# EAGLE design ROMSIMMProgrammer (EAGLE 6.1)
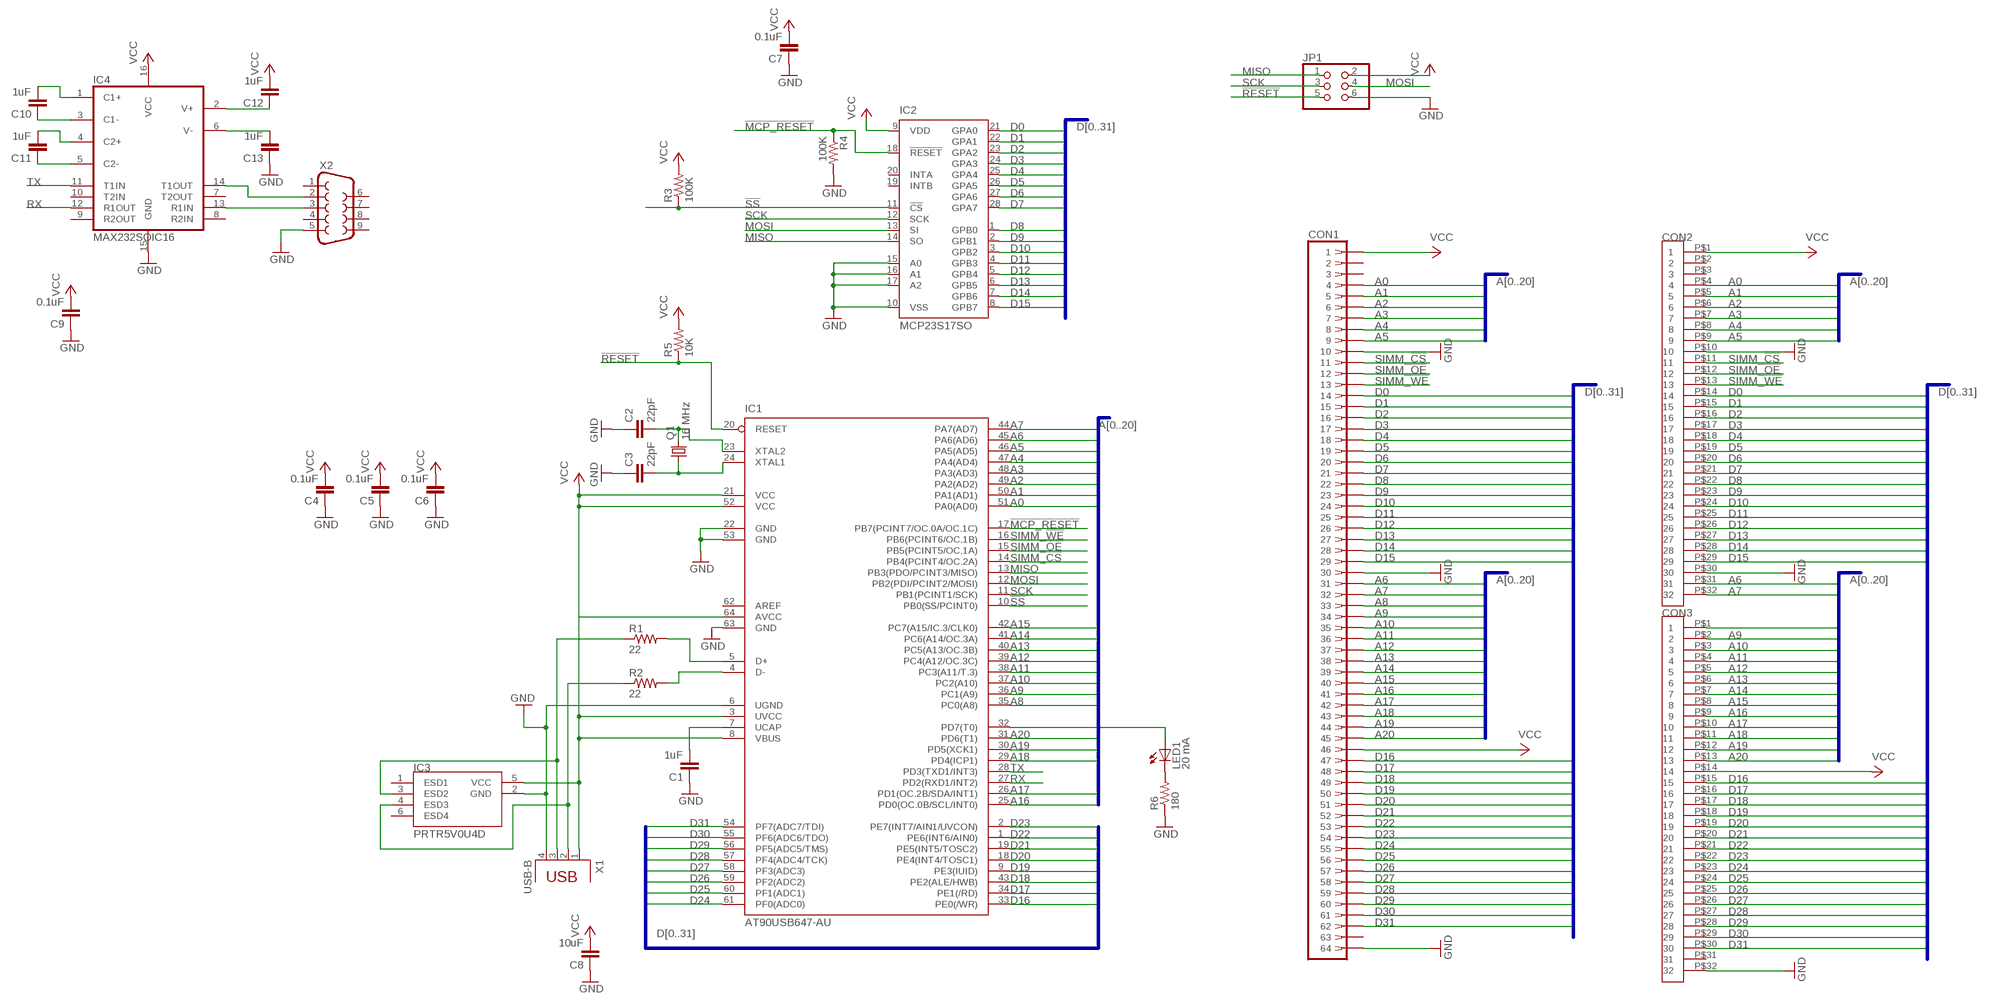
[diagram p0: schematic, sheet 1]

## Parts
C1  1uF  C-EUC0805  [C0805]
C2  22pF  C-EUC0805  [C0805]
C3  22pF  C-EUC0805  [C0805]
C4  0.1uF  C-EUC0805  [C0805]
C5  0.1uF  C-EUC0805  [C0805]
C6  0.1uF  C-EUC0805  [C0805]
C7  0.1uF  C-EUC0805  [C0805]
C8  10uF  C-EUC0805  [C0805]
C9  0.1uF  C-EUC0805  [C0805]
C10  1uF  C-EUC0805  [C0805]
C11  1uF  C-EUC0805  [C0805]
C12  1uF  C-EUC0805  [C0805]
C13  1uF  C-EUC0805  [C0805]
CON1  SIMM64  [822032-2]
CON2  SMS-132-01-G-S  [SMS-132-01-G-S]
CON3  SMS-132-01-G-S  [SMS-132-01-G-S]
IC1  AT90USB647-AU  [TQFP64]
IC2  MCP23S17SO  [SO28W]
IC3  PRTR5V0U4D  [SOT457R_PHILIPS]
IC4  MAX232SOIC16  [SO016]
JP1  PINHD-2X3  [2X03]
LED1  20 mA  LEDCHIP-LED0805  [CHIP-LED0805]
Q1  16 MHz  CRYSTALHC49UP  [HC49UP]
R1  22  R-US_R0805  [R0805]
R2  22  R-US_R0805  [R0805]
R3  100K  R-US_R0805  [R0805]
R4  100K  R-US_R0805  [R0805]
R5  10K  R-US_R0805  [R0805]
R6  180  R-US_R0805  [R0805]
X1  USB-B  PN61729  [PN61729]
X2  DB9FEMALE  [DB9]

## Nets
!MCP_RESET: IC1.17(PB7(PCINT7/OC.0A/OC.1C)) IC2.18(!RESET) R4.1
!RESET: IC1.20(RESET) JP1.5 R5.1
!SS: IC1.10(PB0(SS/PCINT0)) IC2.11(!CS) R3.1
A0: CON1.4 CON2.P$4 IC1.51(PA0(AD0))
A1: CON1.5 CON2.P$5 IC1.50(PA1(AD1))
A2: CON1.6 CON2.P$6 IC1.49(PA2(AD2))
A3: CON1.7 CON2.P$7 IC1.48(PA3(AD3))
A4: CON1.8 CON2.P$8 IC1.47(PA4(AD4))
A5: CON1.9 CON2.P$9 IC1.46(PA5(AD5))
A6: CON1.31 CON2.P$31 IC1.45(PA6(AD6))
A7: CON1.32 CON2.P$32 IC1.44(PA7(AD7))
A8: CON1.33 CON3.P$1 IC1.35(PC0(A8))
A9: CON1.34 CON3.P$2 IC1.36(PC1(A9))
A10: CON1.35 CON3.P$3 IC1.37(PC2(A10))
A11: CON1.36 CON3.P$4 IC1.38(PC3(A11/T.3))
A12: CON1.37 CON3.P$5 IC1.39(PC4(A12/OC.3C))
A13: CON1.38 CON3.P$6 IC1.40(PC5(A13/OC.3B))
A14: CON1.39 CON3.P$7 IC1.41(PC6(A14/OC.3A))
A15: CON1.40 CON3.P$8 IC1.42(PC7(A15/IC.3/CLK0))
A16: CON1.41 CON3.P$9 IC1.25(PD0(OC.0B/SCL/INT0))
A17: CON1.42 CON3.P$10 IC1.26(PD1(OC.2B/SDA/INT1))
A18: CON1.43 CON3.P$11 IC1.29(PD4(ICP1))
A19: CON1.44 CON3.P$12 IC1.30(PD5(XCK1))
A20: CON1.45 CON3.P$13 IC1.31(PD6(T1))
D0: CON1.14 CON2.P$14 IC2.21(GPA0)
D1: CON1.15 CON2.P$15 IC2.22(GPA1)
D2: CON1.16 CON2.P$16 IC2.23(GPA2)
D3: CON1.17 CON2.P$17 IC2.24(GPA3)
D4: CON1.18 CON2.P$18 IC2.25(GPA4)
D5: CON1.19 CON2.P$19 IC2.26(GPA5)
D6: CON1.20 CON2.P$20 IC2.27(GPA6)
D7: CON1.21 CON2.P$21 IC2.28(GPA7)
D8: CON1.22 CON2.P$22 IC2.1(GPB0)
D9: CON1.23 CON2.P$23 IC2.2(GPB1)
D10: CON1.24 CON2.P$24 IC2.3(GPB2)
D11: CON1.25 CON2.P$25 IC2.4(GPB3)
D12: CON1.26 CON2.P$26 IC2.5(GPB4)
D13: CON1.27 CON2.P$27 IC2.6(GPB5)
D14: CON1.28 CON2.P$28 IC2.7(GPB6)
D15: CON1.29 CON2.P$29 IC2.8(GPB7)
D16: CON1.47 CON3.P$15 IC1.33(PE0(/WR))
D17: CON1.48 CON3.P$16 IC1.34(PE1(/RD))
D18: CON1.49 CON3.P$17 IC1.43(PE2(ALE/HWB))
D19: CON1.50 CON3.P$18 IC1.9(PE3(IUID))
D20: CON1.51 CON3.P$19 IC1.18(PE4(INT4/TOSC1))
D21: CON1.52 CON3.P$20 IC1.19(PE5(INT5/TOSC2))
D22: CON1.53 CON3.P$21 IC1.1(PE6(INT6/AIN0))
D23: CON1.54 CON3.P$22 IC1.2(PE7(INT7/AIN1/UVCON))
D24: CON1.55 CON3.P$23 IC1.61(PF0(ADC0))
D25: CON1.56 CON3.P$24 IC1.60(PF1(ADC1))
D26: CON1.57 CON3.P$25 IC1.59(PF2(ADC2))
D27: CON1.58 CON3.P$26 IC1.58(PF3(ADC3))
D28: CON1.59 CON3.P$27 IC1.57(PF4(ADC4/TCK))
D29: CON1.60 CON3.P$28 IC1.56(PF5(ADC5/TMS))
D30: CON1.61 CON3.P$29 IC1.55(PF6(ADC6/TDO))
D31: CON1.62 CON3.P$30 IC1.54(PF7(ADC7/TDI))
D+: IC3.3(ESD2) R1.1 X1.3
D-: IC3.4(ESD3) R2.1 X1.2
GND [thick]: C1.1 C2.1 C3.1 C4.1 C5.1 C6.1 C7.1 C8.1 C9.1 C13.1 CON1.10 CON1.30 CON1.64 CON2.P$10 CON2.P$30 CON3.P$32 IC1.6(UGND) IC1.22(GND) IC1.53(GND) IC1.63(GND) IC2.10(VSS) IC2.15(A0) IC2.16(A1) IC2.17(A2) IC3.2(GND) IC4.15(GND) JP1.6 R4.2 R6.1 X1.4 X2.5
MISO: IC1.13(PB3(PDO/PCINT3/MISO)) IC2.14(SO) JP1.1
MOSI: IC1.12(PB2(PDI/PCINT2/MOSI)) IC2.13(SI) JP1.4
N$1: IC1.5(D+) R1.2
N$2: IC1.4(D-) R2.2
N$3: C2.2 IC1.23(XTAL2) Q1.2
N$4: C3.2 IC1.24(XTAL1) Q1.1
N$5: C10.2 IC4.1(C1+)
N$6: C1.2 IC1.7(UCAP)
N$7: C10.1 IC4.3(C1-)
N$8: C11.1 IC4.5(C2-)
N$9: C11.2 IC4.4(C2+)
N$10: C12.1 IC4.2(V+)
N$11: C13.2 IC4.6(V-)
N$12: IC4.14(T1OUT) X2.2
N$13: IC4.13(R1IN) X2.3
N$14: IC1.32(PD7(T0)) LED1.A
N$15: LED1.C R6.2
RX: IC1.27(PD2(RXD1/INT2)) IC4.12(R1OUT)
SCK: IC1.11(PB1(PCINT1/SCK)) IC2.12(SCK) JP1.3
SIMM_!CS: CON1.11 CON2.P$11 IC1.14(PB4(PCINT4/OC.2A))
SIMM_!OE: CON1.12 CON2.P$12 IC1.15(PB5(PCINT5/OC.1A))
SIMM_!WE: CON1.13 CON2.P$13 IC1.16(PB6(PCINT6/OC.1B))
TX: IC1.28(PD3(TXD1/INT3)) IC4.11(T1IN)
VCC [thick]: C4.2 C5.2 C6.2 C7.2 C8.2 C9.2 C12.2 CON1.1 CON1.46 CON2.P$1 CON3.P$14 IC1.3(UVCC) IC1.8(VBUS) IC1.21(VCC) IC1.52(VCC) IC1.64(AVCC) IC2.9(VDD) IC3.5(VCC) IC4.16(VCC) JP1.2 R3.2 R5.2 X1.1
Unconnected: CON1.2 CON1.3 CON1.63 CON2.P$2 CON2.P$3 CON3.P$31 IC1.62(AREF) IC2.19(INTB) IC2.20(INTA) IC3.1(ESD1) IC3.6(ESD4) IC4.7(T2OUT) IC4.8(R2IN) IC4.9(R2OUT) IC4.10(T2IN) X2.1 X2.4 X2.6 X2.7 X2.8 X2.9

## Buses
D[0..31]
A[0..20]

## Library data of the parts
C1-C13 = rcl:C-EU: CAPACITOR, European symbol
CON1 = Doug:SIMM64: AMP connector; OC_FARNELL: unknown; OC_NEWARK: unknown
CON2 CON3 = Doug:SMS-132-01-G-S
IC1 = at90usb:AT90USB647-*: Atmel AT90USB647 AVR Microcontroller with USB Interface and 64kB Flash Memory
IC2 = microchip:MCP23S17: http://ww1.microchip.com/downloads/en/DeviceDoc/21952a.pdf Source: http://ww1.microchip.com/downloads/en/DeviceDoc/21952a.pdf; MF: MICROCHIP; MPN: MCP23S17-E/SO; OC_FARNELL: unknown; OC_NEWARK: 31K2950
IC3 = Doug:PRTR5V0U4D
IC4 = SparkFun:MAX232: RS232 Transceiver Very common IC. This is generically called 'MAX232', but works with the 3V equivalent MAX3232 generic ICs. Field tested and mother approved. Spark Fun Electronics SKU : COM-00316 (DIP) and COM-00589 (SMD)
JP1 = pinhead:PINHD-2X3: PIN HEADER
LED1 = led:LED: LED OSRAM: - CHIPLED LG R971, LG N971, LY N971, LG Q971, LY Q971, LO R971, LY R971 LH N974, LH R974 LS Q976, LO Q976, LY Q976 LO Q996 - Hyper CHIPLED LW Q18S LB Q993, LB Q99A, LB R99A - SideLED LS A670, LO A670, LY A670, LG A670, LP A670 LB A673, LV A673, LT A673, LW A673 LH A674 LY A675 LS A676, LA A676, LO A676, LY A676, LW A676 LS A679, LY A679, LG A679 - Hyper Micro SIDELED® LS Y876, LA Y876, LO Y876, LY Y876 LT Y87S - SmartLED LW L88C, LW L88S LB L89C, LB L89S, LG L890 LS L89K, LO L89K, LY L89K LS L896, LA L896, LO L896, LY L896 - TOPLED LS T670, LO T670, LY T670, LG T670, LP T670 LSG T670, LSP T670, LSY T670, LOP T670, LYG T670 LG T671, LOG T671, LSG T671 LB T673, LV T673, LT T673, LW T673 LH T674 LS T676, LA T676, LO T676, LY T676, LB T676, LH T676, LSB T676, LW T676 LB T67C, LV T67C, LT T67C, LS T67K, LO T67K, LY T67K, LW E67C LS E67B, LA E67B, LO E67B, LY E67B, LB E67C, LV E67C, LT E67C LW T67C LS T679, LY T679, LG T679 LS T770, LO T770, LY T770, LG T770, LP T770 LB T773, LV T773, LT T773, LW T773 LH T774 LS E675, LA E675, LY E675, LS T675 LS T776, LA T776, LO T776, LY T776, LB T776 LHGB T686 LT T68C, LB T68C - Hyper Mini TOPLED® LB M676 - Mini TOPLED Santana® LG M470 LS M47K, LO M47K, LY M47K Source: http://www.osram.convergy.de LUXEON: - LUMILED® LXK2-PW12-R00, LXK2-PW12-S00, LXK2-PW14-U00, LXK2-PW14-V00 LXK2-PM12-R00, LXK2-PM12-S00, LXK2-PM14-U00 LXK2-PE12-Q00, LXK2-PE12-R00, LXK2-PE12-S00, LXK2-PE14-T00, LXK2-PE14-U00 LXK2-PB12-K00, LXK2-PB12-L00, LXK2-PB12-M00, LXK2-PB14-N00, LXK2-PB14-P00, LXK2-PB14-Q00 LXK2-PR12-L00, LXK2-PR12-M00, LXK2-PR14-Q00, LXK2-PR14-R00 LXK2-PD12-Q00, LXK2-PD12-R00, LXK2-PD12-S00 LXK2-PH12-R00, LXK2-PH12-S00 LXK2-PL12-P00, LXK2-PL12-Q00, LXK2-PL12-R00 Source: www.luxeon.com KINGBRIGHT: KA-3528ASYC Source: www.kingbright.com
Q1 = crystal:CRYSTAL: CRYSTAL; OC_FARNELL: unknown; OC_NEWARK: unknown
R1-R6 = rcl:R-US_: RESISTOR, American symbol
X1 = Doug:PN61729: BERG USB connector; OC_FARNELL: unknown; OC_NEWARK: unknown
X2 = SparkFun:DB9: DB9 Connector Standard DB9 (D-Sub 9) serial connector. Can be used for CAN bus as well as RS485 and RS232. Footprint production proven. Spark Fun Electronics SKU : PRT-00429

## Net classes
0 default: width 0.178 mm
1 thick: width 0.508 mm

## Board
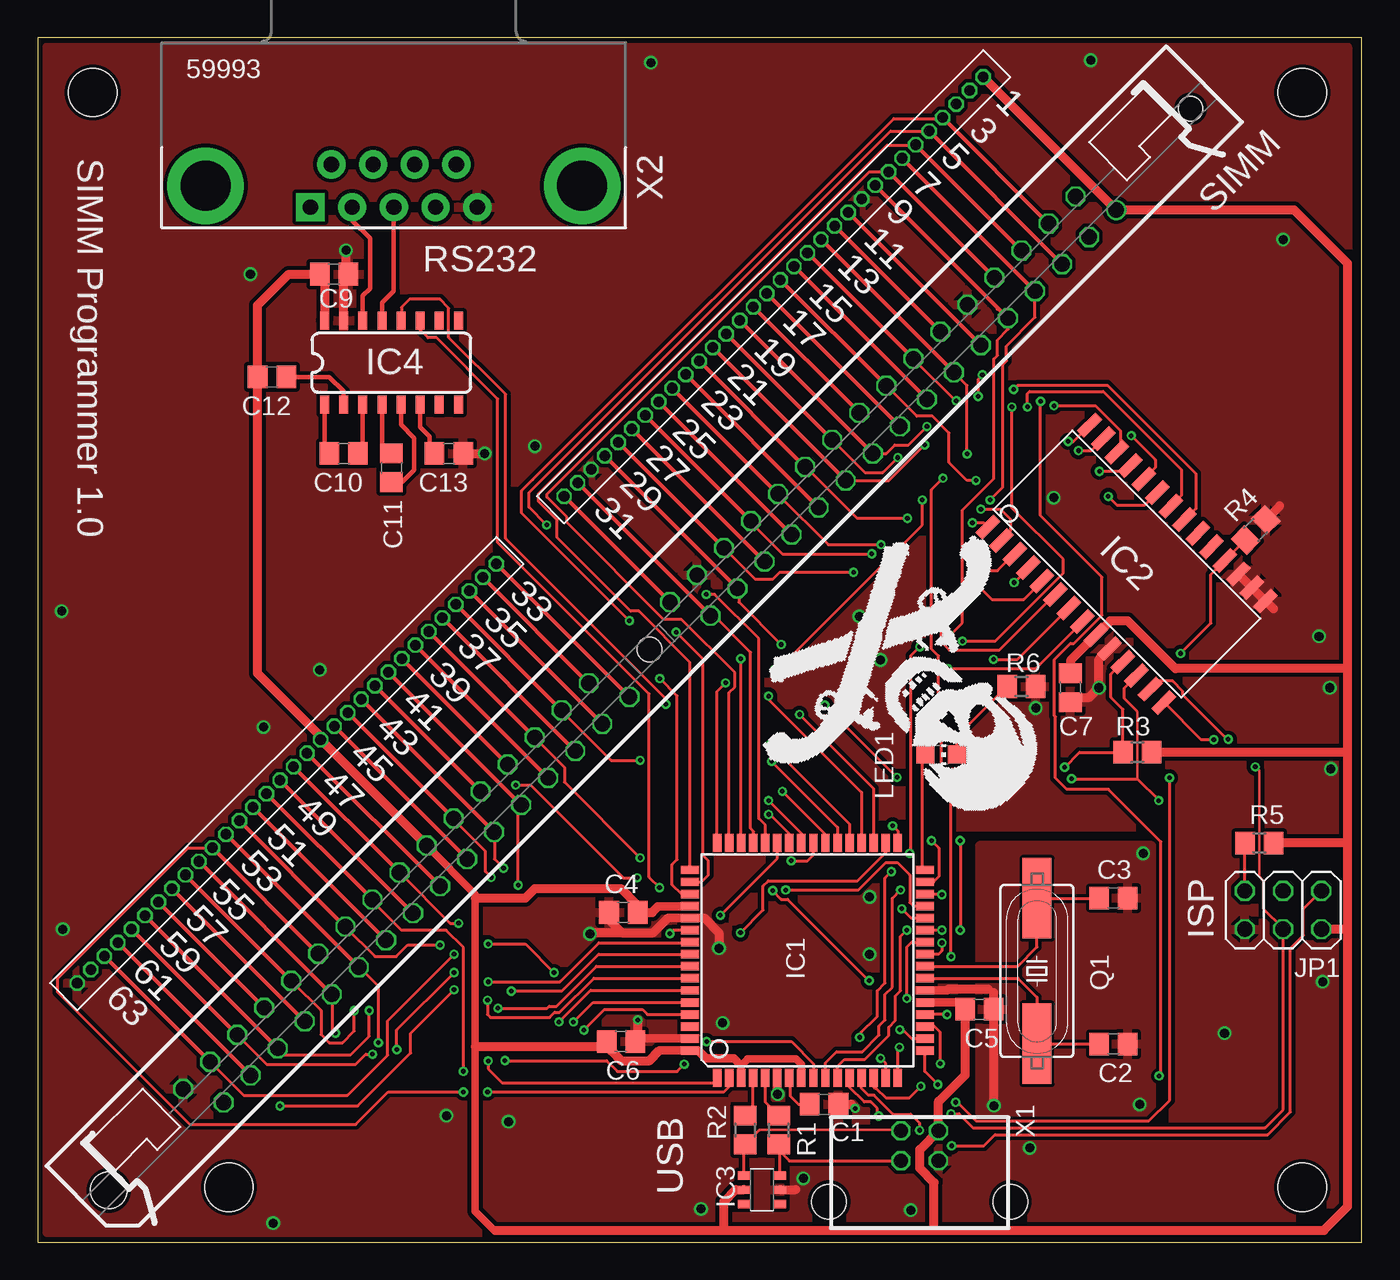
[diagram p1: board, top side]
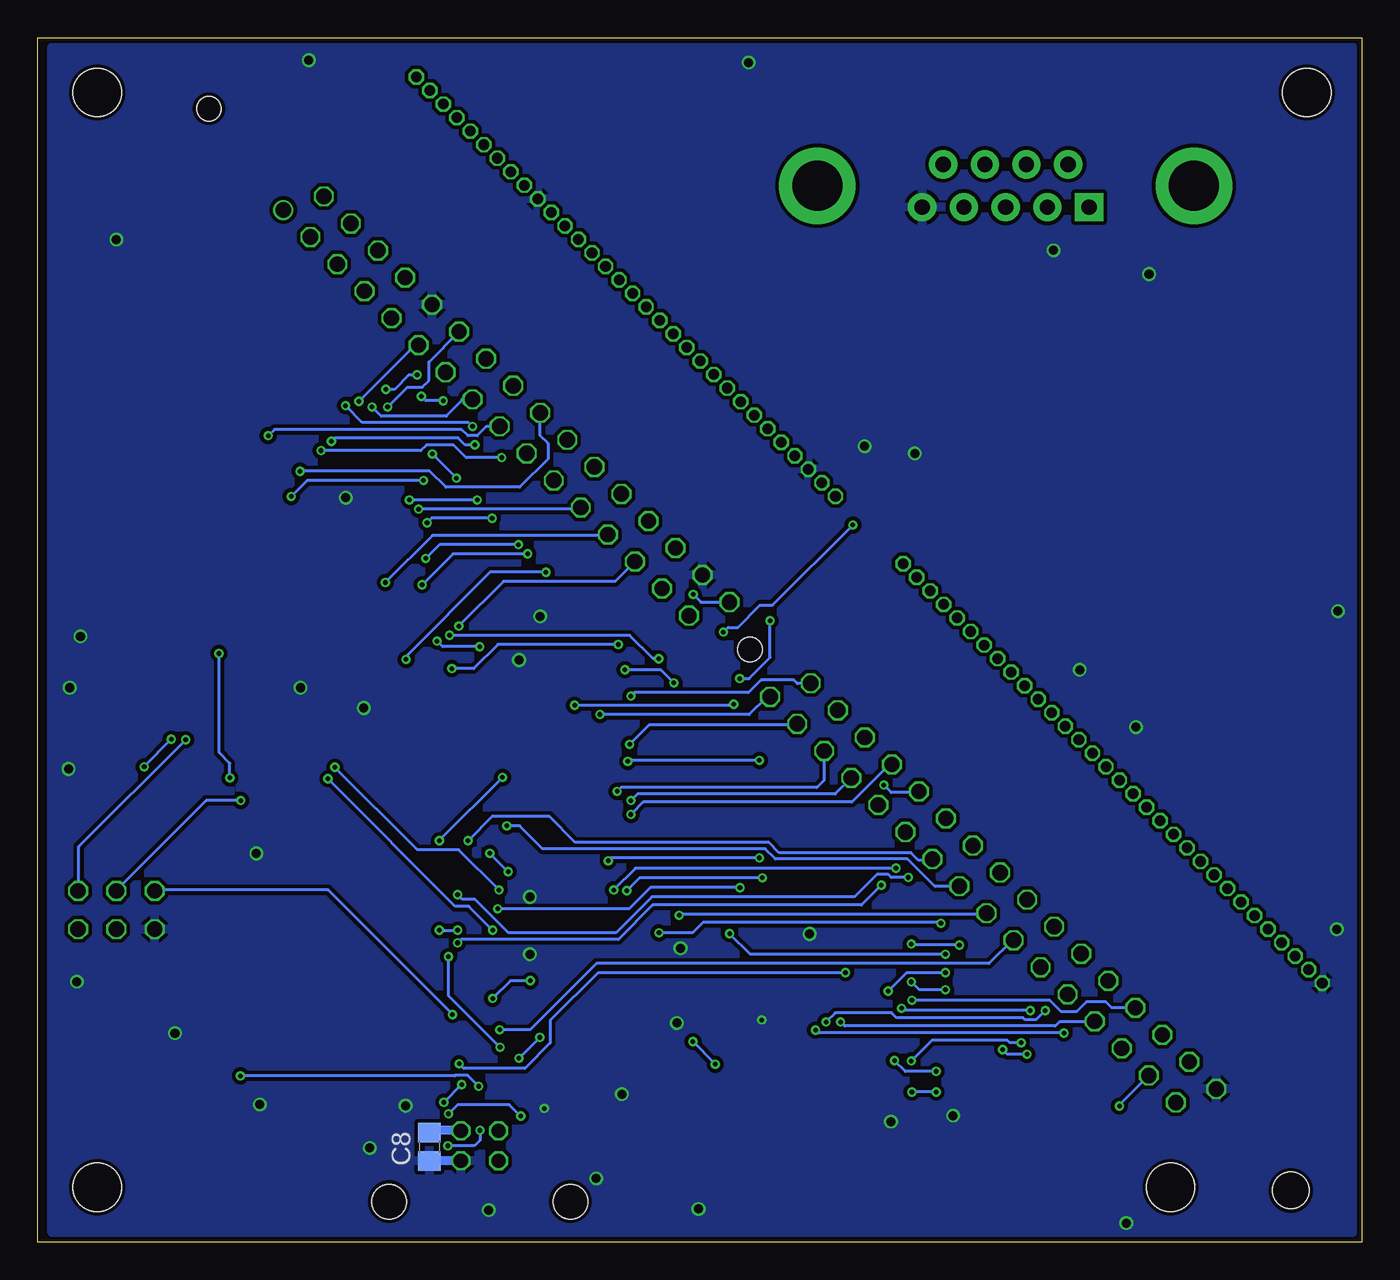
[diagram p2: board, bottom side, seen from below]

Size 87.94 x 80 mm. Coordinates in mm from the lower left corner, seen from the top.
Outline: 0,0 87.94,0 87.94,80 0,80 0,0
Copper layers (1*16): Top 0.035mm / dielectric 1.5mm / Bottom 0.035mm
Design rules: minimum track width 6mil, minimum drill 12mil, track to track 8mil, track to pad 8mil, pad to pad 8mil, via to via 8mil, smd to smd 0mil, copper to edge 10mil, drill to drill 10mil, minimum pad ring 6mil, minimum via ring 6mil, stop-mask expansion 2mil, vias tented up to drill 100mil, thermal gap 10mil
Holes 3.2 mm at 3.65,76.36 83.98,76.36 83.98,3.65 12.7,3.65

### Footprints (pad centres in the part's own frame; a part is rotated, then mirrored left to right if it is on the bottom)
C0805 = smd 1.3 x 1.5: 1 -0.95,0; 2 0.95,0
822032-2 = drill 1.016: 1 42.545,-1.27 | drill 1.016 octagon: 2 41.275,1.27; 3 40.005,-1.27; 4 38.735,1.27; 5 37.465,-1.27; 6 36.195,1.27; 7 34.925,-1.27; 8 33.655,1.27; 9 32.385,-1.27; 10 31.115,1.27; 11 29.845,-1.27; 12 28.575,1.27; 13 27.305,-1.27; 14 26.035,1.27; 15 24.765,-1.27; 16 23.495,1.27; 17 22.225,-1.27; 18 20.955,1.27; 19 19.685,-1.27; 20 18.415,1.27; 21 17.145,-1.27; 22 15.875,1.27; 23 14.605,-1.27; 24 13.335,1.27; 25 12.065,-1.27; 26 10.795,1.27; 27 9.525,-1.27; 28 8.255,1.27; 29 6.985,-1.27; 30 5.715,1.27; 31 4.445,-1.27; 32 3.175,1.27; 33 -3.175,-1.27; 34 -4.445,1.27; 35 -5.715,-1.27; 36 -6.985,1.27; 37 -8.255,-1.27; 38 -9.525,1.27; 39 -10.795,-1.27; 40 -12.065,1.27; 41 -13.335,-1.27; 42 -14.605,1.27; 43 -15.875,-1.27; 44 -17.145,1.27; 45 -18.415,-1.27; 46 -19.685,1.27; 47 -20.955,-1.27; 48 -22.225,1.27; 49 -23.495,-1.27; 50 -24.765,1.27; 51 -26.035,-1.27; 52 -27.305,1.27; 53 -28.575,-1.27; 54 -29.845,1.27; 55 -31.115,-1.27; 56 -32.385,1.27; 57 -33.655,-1.27; 58 -34.925,1.27; 59 -36.195,-1.27; 60 -37.465,1.27; 61 -38.735,-1.27; 62 -40.005,1.27; 63 -41.275,-1.27; 64 -42.545,1.27 | hole 2.438: -50.8,0 | hole 1.626: 50.8,0; 0,0
SMS-132-01-G-S = drill 0.7 pad 1.016 octagon: P$1 0,19.05; P$2 0,17.78; P$3 0,16.51; P$4 0,15.24; P$5 0,13.97; P$6 0,12.7; P$7 0,11.43; P$8 0,10.16; P$9 0,8.89; P$10 0,7.62; P$11 0,6.35; P$12 0,5.08; P$13 0,3.81; P$14 0,2.54; P$15 0,1.27; P$16 0,0; P$17 0,-1.27; P$18 0,-2.54; P$19 0,-3.81; P$20 0,-5.08; P$21 0,-6.35; P$22 0,-7.62; P$23 0,-8.89; P$24 0,-10.16; P$25 0,-11.43; P$26 0,-12.7; P$27 0,-13.97; P$28 0,-15.24; P$29 0,-16.51; P$30 0,-17.78; P$31 0,-19.05; P$32 0,-20.32
TQFP64 = smd 1.194 x 0.559: 1 -7.8,6; 2 -7.8,5.2; 3 -7.8,4.4; 4 -7.8,3.6; 5 -7.8,2.8; 6 -7.8,2; 7 -7.8,1.2; 8 -7.8,0.4; 9 -7.8,-0.4; 10 -7.8,-1.2; 11 -7.8,-2; 12 -7.8,-2.8; 13 -7.8,-3.6; 14 -7.8,-4.4; 15 -7.8,-5.2; 16 -7.8,-6; 33 7.8,-6; 34 7.8,-5.2; 35 7.8,-4.4; 36 7.8,-3.6; 37 7.8,-2.8; 38 7.8,-2; 39 7.8,-1.2; 40 7.8,-0.4; 41 7.8,0.4; 42 7.8,1.2; 43 7.8,2; 44 7.8,2.8; 45 7.8,3.6; 46 7.8,4.4; 47 7.8,5.2; 48 7.8,6 | smd 0.559 x 1.194: 17 -6,-7.8; 18 -5.2,-7.8; 19 -4.4,-7.8; 20 -3.6,-7.8; 21 -2.8,-7.8; 22 -2,-7.8; 23 -1.2,-7.8; 24 -0.4,-7.8; 25 0.4,-7.8; 26 1.2,-7.8; 27 2,-7.8; 28 2.8,-7.8; 29 3.6,-7.8; 30 4.4,-7.8; 31 5.2,-7.8; 32 6,-7.8; 49 6,7.8; 50 5.2,7.8; 51 4.4,7.8; 52 3.6,7.8; 53 2.8,7.8; 54 2,7.8; 55 1.2,7.8; 56 0.4,7.8; 57 -0.4,7.8; 58 -1.2,7.8; 59 -2,7.8; 60 -2.8,7.8; 61 -3.6,7.8; 62 -4.4,7.8; 63 -5.2,7.8; 64 -6,7.8
SO28W = smd 0.65 x 1.7: 1 -7.62,-4.78; 2 -6.35,-4.78; 3 -5.08,-4.78; 4 -3.81,-4.78; 5 -2.54,-4.78; 6 -1.27,-4.78; 7 0,-4.78; 8 1.27,-4.78; 9 2.54,-4.78; 10 3.81,-4.78; 11 5.08,-4.78; 12 6.35,-4.78; 13 7.62,-4.78; 14 8.89,-4.78; 15 8.89,4.78; 16 7.62,4.78; 17 6.35,4.78; 18 5.08,4.78; 19 3.81,4.78; 20 2.54,4.78; 21 1.27,4.78; 22 0,4.78; 23 -1.27,4.78; 24 -2.54,4.78; 25 -3.81,4.78; 26 -5.08,4.78; 27 -6.35,4.78; 28 -7.62,4.78
SOT457R_PHILIPS = smd 0.55 x 0.8: 1 -0.95,-1.2; 2 0,-1.2; 3 0.95,-1.2; 4 0.95,1.2; 5 0,1.2; 6 -0.95,1.2
SO016 = smd 0.6 x 1.2: 1 -4.445,-2.8; 2 -3.175,-2.8; 3 -1.905,-2.8; 4 -0.635,-2.8; 5 0.635,-2.8; 6 1.905,-2.8; 7 3.175,-2.8; 8 4.445,-2.8; 9 4.445,2.8; 10 3.175,2.8; 11 1.905,2.8; 12 0.635,2.8; 13 -0.635,2.8; 14 -1.905,2.8; 15 -3.175,2.8; 16 -4.445,2.8
2X03 = drill 1.016 octagon: 1 -2.54,-1.27; 2 -2.54,1.27; 3 0,-1.27; 4 0,1.27; 5 2.54,-1.27; 6 2.54,1.27
CHIP-LED0805 = smd 1.2 x 1.2: A 0,-1.05; C 0,1.05
HC49UP = smd 5.334 x 1.93: 1 -4.826,0; 2 4.826,0
R0805 = smd 1.3 x 1.5: 1 -0.95,0; 2 0.95,0
PN61729 = drill 0.95 octagon: 1 1.25,4.71; 2 -1.25,4.71; 3 -1.25,2.71; 4 1.25,2.71 | hole 2.3: -6.02,0; 6.02,0
DB9 = drill 1.016 pad 1.88 square: 1 -5.54,-1.42 | drill 1.016 pad 1.88: 2 -2.77,-1.42; 3 0,-1.42; 4 2.77,-1.42; 5 5.54,-1.42; 6 -4.15,1.42; 7 -1.38,1.42; 8 1.38,1.42; 9 4.15,1.42 | drill 3.302 pad 5.08: G1 -12.5,0; G2 12.5,0

### Placement (x,y rotation side)
C1  52.23,9.17 180 top
C2  71.44,13.18 180 top
C3  71.44,22.86 180 top
C4  38.89,21.91 0 top
C5  62.55,15.48 180 top
C6  38.73,13.34 180 top
C7  68.58,36.83 90 top
C8  61.91,6.35 90 bottom
C9  19.68,64.29 180 top
C10  20.32,52.39 180 top
C11  23.5,51.44 90 top
C12  15.56,57.47 180 top
C13  27.3,52.39 180 top
CON1  40.64,39.37 45 top
CON2  49.33,63.91 315 top
CON3  17,31.58 315 top
IC1  51.12,18.73 90 top
IC2  71.86,45.5 315 top
IC3  48.1,3.49 90 top
IC4  23.5,58.42 0 top
JP1  82.71,22.07 180 top
LED1  60.01,32.38 270 top
Q1  66.36,18.02 270 top
R1  49.21,7.46 90 top
R2  46.99,7.46 90 top
R3  73.03,32.54 0 top
R4  80.88,47.31 45 top
R5  81.12,26.51 0 top
R6  65.33,36.91 180 top
U$1  [JOLLYROGER]  59.77,49.61 225 top
X1  58.58,2.7 0 top
X2  23.65,70.17 0 top

### Tracks (layer width: path | path; a pad name or v marks a point on that pad's centre or on a via)
!MCP_RESET  (via drill 0.3)
  Top 0.203: IC1.17 58.92,11.34 v59.78,10.48 | R4.1 80.18,46.64 IC2.18 77.91,44.36 77.91,41.11 v75.89,39.1 | v75.17,30.85 75.17,9.45 73.81,8.08 62.3,8.08 61.08,9.3 v60.96,9.3
  Bottom 0.203: v60.96,9.3 v59.78,10.48 | v75.89,39.1 75.89,32.54 75.17,31.81 v75.17,30.85
!RESET  (via drill 0.3)
  Top 0.203: v60.39,15.12 60.35,15.16 58.95,15.16 IC1.20 | R5.1 JP1.5
  Bottom 0.203: v60.39,15.12 68.66,23.39 80.11,23.39 JP1.5
!SS  (via drill 0.3)
  Top 0.203: v68.2,31.55 69.19,32.54 R3.1 72.08,35.4 71.28,36.2 71.28,37.73 IC2.11 | IC1.10 52.32,11.93 53.05,12.66 54.77,12.66 55.88,13.77 55.88,14.37 56.28,14.76 56.28,16.47 56.75,16.95 56.75,22.84 v57.3,23.39
  Bottom 0.203: v57.3,23.39 59.97,26.06 62.71,26.06 v68.2,31.55
A0  (via drill 0.3)
  Top 0.203: IC1.51 43.28,23.1 42.78,23.1 42.14,23.74 42.14,25.09 42.47,25.42 42.47,36.29 v41.32,37.44 | v39.29,41.27 32.94,47.62 32.15,48.42 32.15,49.91 32.88,50.64 56.86,74.62 60.04,74.62 CON2.P$4
  Top 0.254: CON2.P$4 CON1.4
  Bottom 0.203: v41.32,37.44 40.7,37.44 39.29,38.84 v39.29,41.27
A1  (via drill 0.3)
  Top 0.203: v42.4,40.53 44.2,38.73 44.2,25.68 44.54,25.34 44.54,24.39 44.08,23.93 IC1.50 | v33.8,47.64 32.62,48.82 32.62,49.78 56.63,73.79 CON2.P$5
  Top 0.254: CON2.P$5 CON1.5
  Bottom 0.203: v33.8,47.64 39.13,42.31 39.98,42.31 41.44,40.84 42.08,40.84 v42.4,40.53
A2
  Top 0.203: 43.28,24.77 IC1.49 43.32,38.52 39.93,41.91 39.39,41.91 34.49,46.8 34.49,47.97 33.26,49.2 33.26,49.72 56.41,72.87 58.29,72.87 CON2.P$6
  Top 0.254: CON2.P$6 CON1.6
A3  (via drill 0.3)
  Top 0.203: v63.25,49.3 64.08,50.14 64.08,58.28 64.33,58.53 64.33,59.53 66.23,61.43 CON1.7 | IC1.48 45.12,36.59 v45.68,37.15 | v48.94,38.02 49.14,38.02 58.75,47.64 v58.75,49.3
  Top 0.254: CON1.7 CON2.P$7
  Bottom 0.203: v45.68,37.15 46.55,38.02 v48.94,38.02 | v58.75,49.3 v63.25,49.3
A4
  Top 0.203: IC1.47 45.92,36.51 46.29,36.88 46.29,37.83 42.75,41.37 41.57,41.37 35.14,47.8 35.14,48.15 33.81,49.48 33.81,49.69 55.22,71.1 CON2.P$8
  Top 0.254: CON2.P$8 CON1.8
A5  (via drill 0.3)
  Top 0.203: v60.58,40.31 61.4,41.13 61.4,48.61 63.5,50.71 63.5,58.66 63.74,58.9 63.74,59.93 64.44,60.63 CON1.9 | 63.78,62.03 63.7,61.95 | IC1.46 46.72,38.73 v46.69,38.76
  Top 0.254: CON2.P$9 63.78,62.03 CON1.9
  Bottom 0.203: v60.58,40.31 48.62,40.31 47.06,38.76 v46.69,38.76
A6
  Top 0.203: CON1.31 44.9,41.62 47.34,39.18 47.34,27.49 47.55,27.29 47.55,26.56 IC1.45
  Top 0.254: CON1.31 CON2.P$31
A7  (via drill 0.3)
  Top 0.203: v44.4,43.02 44.95,43.02 47.89,40.09 47.89,28.15 48.32,27.72 IC1.44
  Top 0.254: CON1.32 CON2.P$32
  Bottom 0.203: v44.4,43.02 43.88,42.51 CON1.32
A8  (via drill 0.3)
  Top 0.203: IC1.35 55.52,30.13 v50.6,35.05
  Top 0.254: CON3.P$1 CON1.33
  Bottom 0.203: v50.6,35.05 40.69,35.05 39.55,36.2 39.32,36.2 CON1.33
A9  (via drill 0.3)
  Top 0.203: v48.54,36.27 48.54,36.06 54.71,29.89 IC1.36
  Top 0.254: CON3.P$2 CON1.34
  Bottom 0.203: v48.54,36.27 48.31,36.5 40.73,36.5 39.89,37.34 37.72,37.34 37.49,37.11 36.65,37.11 36.64,37.12 CON1.34
A10  (via drill 0.3)
  Top 0.203: IC1.37 53.92,27.77 v48.62,33.07
  Top 0.254: CON1.35 CON3.P$3
  Bottom 0.203: v48.62,33.07 47.32,34.37 37.57,34.37 CON1.35
A11  (via drill 0.3)
  Top 0.203: v40.01,32 38.08,32 34.8,35.28 CON1.36 | IC1.38 53.12,27.57 v48.75,31.94
  Top 0.254: CON3.P$4 CON1.36
  Bottom 0.203: v48.75,31.94 48.68,32 v40.01,32
A12  (via drill 0.3)
  Top 0.203: IC1.39 52.32,27.09 v49.45,29.95
  Top 0.254: CON1.37 CON3.P$5
  Bottom 0.203: CON1.37 35.7,30.7 36.2,30.2 49.2,30.2 v49.45,29.95
A13  (via drill 0.3)
  Top 0.203: v40.01,25.53 34.98,30.56 34.98,31.55 33.07,33.45 | IC1.40 51.52,25.72 51.13,25.33 v50.05,25.33
  Top 0.254: CON3.P$6 CON1.38 33.01,33.52 33.07,33.45
  Bottom 0.203: v50.05,25.33 49.85,25.53 v40.01,25.53
A14  (via drill 0.3)
  Top 0.203: IC1.41 50.72,27.16 v48.54,29.34
  Top 0.254: CON3.P$7 CON1.39
  Bottom 0.203: v48.54,29.34 48.11,29.77 34.98,29.77 CON1.39
A15  (via drill 0.3)
  Top 0.203: IC1.42 49.92,27.12 48.62,28.42 v48.54,28.42
  Top 0.254: CON3.P$8 CON1.40
  Bottom 0.203: 31.24,31.7 31.39,31.7 33.86,29.23 47.73,29.23 v48.54,28.42
  Bottom 0.254: 31.24,31.7 CON1.40
A16  (via drill 0.3)
  Top 0.203: v60.05,19.89 60.05,19.36 59.82,19.13 IC1.25 | v31.91,23.72 31.91,28.84 CON1.41
  Top 0.254: CON1.41 CON3.P$9
  Bottom 0.203: v60.05,19.89 59.81,20.12 49.38,20.12 47.09,22.4 33.22,22.4 v31.91,23.72
A17  (via drill 0.3)
  Top 0.203: v55.22,17.37 49.81,22.78 49.38,22.78 v48.81,23.35 | IC1.26 58.04,19.93 57.72,19.61 v57.72,16.2 | v31.74,30.37 32.73,30.37 32.77,30.33 38.73,24.37 38.88,24.21 v39.81,24.21
  Top 0.254: CON3.P$10 CON1.42
  Bottom 0.203: v57.72,16.2 56.54,17.37 v55.22,17.37 | v31.74,30.37 31.24,29.87 29.48,29.87 CON1.42 | v39.81,24.21 47.95,24.21 v48.81,23.35
A18  (via drill 0.3)
  Top 0.203: 57.91,24.39 57.08,25.22 56.33,25.22 54.5,23.39 v49.68,23.39 | v30.94,24.84 30.33,25.45 30.33,27.13 | IC1.29 58.14,22.33 57.91,22.56 57.91,24.39 | 57.91,24.39
  Top 0.254: CON3.P$11 CON1.43 30.33,27.23 30.33,27.13
  Bottom 0.203: v49.68,23.39 48.23,24.84 v30.94,24.84
A19  (via drill 0.3)
  Top 0.203: 27.66,28.04 29.73,25.97 29.73,24.62 v30.12,24.23 | IC1.30 58.96,23.09 v60.05,23.09
  Top 0.254: CON3.P$12 CON1.44 27.66,28.1 27.66,28.04
  Bottom 0.203: v60.05,23.09 59.74,22.78 58.9,22.78 56.67,20.56 49.53,20.56 47.14,22.95 33.68,22.95 32.19,24.43 31.45,24.43 31.25,24.23 v30.12,24.23
A20  (via drill 0.3)
  Top 0.203: IC1.31 59.49,23.93 59.85,24.29 59.85,26.18 v59.36,26.67
  Top 0.254: CON3.P$13 CON1.45
  Bottom 0.203: v59.36,26.67 57.76,28.27 53.95,28.27 52.24,26.56 39.38,26.56 38.69,25.87 29.94,25.87 29.44,25.38 28.57,25.38
  Bottom 0.254: CON1.45 28.57,25.39 28.57,25.38
D0  (via drill 0.3)
  Top 0.203: 58.22,58.6 60.93,55.89 v61.01,55.89 | v62.45,56.18 62.45,57.32 v62.74,57.6 | v64.81,56.64 65.09,56.92 71.04,56.92 76.91,51.05 76.91,48.72 76.18,47.98 IC2.21
  Top 0.254: CON2.P$14 CON1.14 58.15,58.66 58.22,58.6
  Bottom 0.203: v61.01,55.89 62.16,55.89 v62.45,56.18 | v62.74,57.6 63.29,57.6 64.25,56.64 v64.81,56.64
D1  (via drill 0.3)
  Top 0.203: v65.73,55.47 65.73,56.36 65.87,56.5 70.77,56.5 75.96,51.31 75.96,49.6 IC2.22
  Top 0.254: CON2.P$15 CON1.15
  Bottom 0.203: v65.73,55.47 65.12,54.86 60.81,54.86 59.74,55.93
  Bottom 0.254: 59.74,55.93 59.69,55.98 CON1.15
D2  (via drill 0.3)
  Top 0.203: CON1.16 58.38,54.86 59.42,54.86 60.52,53.75 60.52,51.79 61.72,50.6 v62.31,50.6 | v71.09,49.53 71.65,48.97 73.54,48.97 IC2.23
  Top 0.254: CON1.16 CON2.P$16
  Bottom 0.203: v71.09,49.53 70.03,50.6 v62.31,50.6
D3  (via drill 0.3)
  Top 0.203: IC2.24 74.22,51.45 74.22,51.98 v72.62,53.57
  Top 0.254: CON2.P$17 CON1.17
  Bottom 0.203: 57.3,54.18 58.14,54.18 58.75,53.57 59.37,53.57 59.78,53.99 72.21,53.99 v72.62,53.57
  Bottom 0.254: 57.3,54.18 57.29,54.19 CON1.17
D4  (via drill 0.3)
  Top 0.203: IC2.25 72.53,51.58 72.16,51.21 v70.51,51.21
  Top 0.254: CON1.18 CON2.P$18
  Bottom 0.203: v70.51,51.21 61.89,51.21 60.83,50.14 55.92,50.14 54.05,52 54.05,53.06 54.56,53.57 CON1.18
D5  (via drill 0.3)
  Top 0.203: v67.49,55.56 70.25,55.56 71.91,53.9 71.91,52.74 IC2.26 | v59.05,54.18 57.84,52.96 56.93,52.96 56.36,52.39 CON1.19
  Top 0.254: CON1.19 CON2.P$19
  Bottom 0.203: v59.05,54.18 59.32,54.44 66.38,54.44 v67.49,55.56
D6  (via drill 0.3)
  Top 0.203: v69.12,52.58 69.96,52.58 IC2.27 | v57.12,52.11 56.13,51.12 54.93,51.12 CON1.20
  Top 0.254: CON1.20 CON2.P$20
  Bottom 0.203: v69.12,52.58 62.5,52.58 62.12,52.96 60.32,52.96 59.47,52.11 v57.12,52.11
D7  (via drill 0.3)
  Top 0.203: v68.43,53.19 68.77,53.19 IC2.28 69.85,54.29 | CON1.21 56.54,50.59 v58.9,52.96
  Top 0.254: CON2.P$21 CON1.21
  Bottom 0.203: v68.43,53.19 68.19,53.42 60,53.42 59.54,52.96 v58.9,52.96
D8  (via drill 0.3)
  Top 0.203: v57.76,48.08 54.41,48.08 51.05,51.44 51.03,51.44 CON1.22 | 62.83,47.51 IC2.1 62.82,47.78 v62.07,47.78
  Top 0.254: CON1.22 CON2.P$22
  Bottom 0.203: v57.76,48.08 61.77,48.08 v62.07,47.78
D9  (via drill 0.3)
  Top 0.203: v62.64,48.69 63.94,48.69 64.61,48.02 64.61,47.24 IC2.2
  Top 0.254: CON2.P$23 CON1.23
  Bottom 0.203: v62.64,48.69 51.97,48.69 51.89,48.77 CON1.23
D10  (via drill 0.3)
  Top 0.203: v56.01,46.33 52.5,46.33 49.23,49.61 49.23,49.64 CON1.24 | v62.17,45.41 62.98,44.61 63.74,44.61 64.84,45.71 IC2.3
  Top 0.254: CON2.P$24 CON1.24
  Bottom 0.203: v62.17,45.41 61.26,46.33 v56.01,46.33
D11  (via drill 0.3)
  Top 0.203: v64.85,43.81 65.79,44.76 IC2.4
  Top 0.254: CON2.P$25 CON1.25
  Bottom 0.203: v64.85,43.81 61.72,46.94 50.13,46.94 CON1.25
D12  (via drill 0.3)
  Top 0.203: v55.4,45.72 49.45,45.72 47.4,47.78 47.4,47.88 CON1.26 | v62.41,43.66 63.37,42.7 65.48,42.7 66.69,43.91 IC2.5
  Top 0.254: CON2.P$26 CON1.26
  Bottom 0.203: v62.41,43.66 60.35,45.72 v55.4,45.72
D13  (via drill 0.3)
  Top 0.203: v59.97,40.92 59.97,39.88 60.53,39.32 63.86,39.32 67.56,43.02 IC2.6
  Top 0.254: CON2.P$27 CON1.27
  Bottom 0.203: v59.97,40.92 57,43.89 49.59,43.89 CON1.27
D14  (via drill 0.3)
  Top 0.203: v54.18,44.5 49.28,44.5 48.83,44.05 47.62,44.05 45.58,46.1 CON1.28 | v63.48,38.71 65.07,38.71 IC2.7
  Top 0.254: CON2.P$28 CON1.28
  Bottom 0.203: v63.48,38.71 63.48,38.92 57.89,44.5 v54.18,44.5
D15  (via drill 0.3)
  Top 0.203: v60.43,38.1 66.29,38.1 69.38,41.19 IC2.8 | v49.38,39.7 46.56,42.52 46.56,43.36 46.53,43.36 CON1.29
  Top 0.254: CON2.P$29 CON1.29
  Bottom 0.203: v49.38,39.7 57.38,39.7 58.98,38.1 v60.43,38.1
D16  (via drill 0.3)
  Top 0.203: IC1.33 57.12,27.32 v56.78,27.66
  Top 0.254: CON3.P$15 CON1.47
  Bottom 0.203: v56.78,27.66 55.93,27.66 54.41,26.14 39.63,26.14 38.94,25.45 30.18,25.45 28.35,23.62 26.75,23.62
  Bottom 0.254: 26.75,23.62 CON1.47
D17  (via drill 0.3)
  Top 0.203: v46.67,20.56 48.18,22.07 48.18,23.65 48.53,24 54.44,24 56.31,25.87 56.31,26.52 IC1.34 | v27.95,21.18 27.39,21.18 CON1.48
  Top 0.254: CON3.P$16 CON1.48
  Bottom 0.203: v27.95,21.18 28.03,21.26 43.74,21.26 44.44,20.56 v46.67,20.56
D18  (via drill 0.3)
  Top 0.203: IC1.43 49.12,25.5 v45.34,21.72
  Top 0.254: CON1.49 CON3.P$17
  Bottom 0.203: v45.34,21.72 45.26,21.79 24.99,21.79
  Bottom 0.254: 24.99,21.79 CON1.49
D19  (via drill 0.3)
  Top 0.203: v44.42,13.34 50.05,13.34 51.52,11.87 IC1.9 | v42.94,11.82 42.47,11.35 38.5,11.35 37.78,12.06 v31.04,12.06 | v28.27,11.35 28.27,19.58 27.13,20.72 24.16,20.72 22.25,22.63
  Top 0.254: CON3.P$18 CON1.50 22.23,22.65 22.25,22.63
  Bottom 0.203: v28.27,11.35 30.32,11.35 v31.04,12.06 | v44.42,13.34 42.94,11.85 v42.94,11.82
D20  (via drill 0.3)
  Top 0.203: v57.26,14.12 57.45,14.12 58.04,13.53 IC1.18
  Top 0.254: CON3.P$19 CON1.51
  Bottom 0.203: v57.26,14.12 55.23,14.12 50.83,18.52 24.77,18.52 23.22,20.06
  Bottom 0.254: CON1.51 23.22,20.06
D21  (via drill 0.3)
  Top 0.203: v34.29,17.91 32.38,19.81 v29.92,19.81 | v59.94,11.86 59.94,13.96 59.57,14.33 IC1.19 | v26.72,19.74 24.58,19.74 23.82,18.97 22.4,18.97 20.5,20.88
  Top 0.254: CON3.P$20 CON1.52 20.5,20.9 20.5,20.88
  Bottom 0.203: v59.94,11.86 59.64,11.55 55.58,11.55 53.9,13.24 53.9,14.72 50.71,17.91 v34.29,17.91 | v29.92,19.81 29.84,19.74 v26.72,19.74
D22  (via drill 0.3)
  Top 0.203: v22.63,13.25 22.63,16.99 21.41,18.21 21.39,18.21 CON1.53 | v29.92,12.05 29.92,11.52 30.83,10.61 45.11,10.61 IC1.1
  Top 0.254: CON1.53 CON3.P$21
  Bottom 0.203: v29.92,12.05 28.55,13.41 23.53,13.41 23.37,13.25 v22.63,13.25
D23  (via drill 0.3)
  Top 0.203: v28.27,9.98 23.28,9.98 21.13,7.83 10.11,7.83 1.35,16.59 1.35,17.54 10,26.2 CON3.P$22 | v29.88,9.98 45.56,9.98 45.92,10.34 IC1.2
  Top 0.254: CON3.P$22 CON1.54
  Bottom 0.203: v28.27,9.98 v29.88,9.98
D24  (via drill 0.3)
  Top 0.203: v19.78,13.9 19.58,14.1 19.58,16.38 19.54,16.43 CON1.55 | v36.27,14.1 37.64,15.46 40.16,15.46 | IC1.61 40.49,15.13 40.16,15.46 | 40.16,15.46
  Top 0.254: CON1.55 CON3.P$23
  Bottom 0.203: v19.78,13.9 36.07,13.9 v36.27,14.1
D25  (via drill 0.3)
  Top 0.203: 16.92,17.3 18.82,15.39 18.82,13.8 19.37,13.26 20.24,13.26 21.02,14.04 v21.02,15.39 | v35.58,14.63 36.88,15.93 IC1.60
  Top 0.254: CON3.P$24 CON1.56 16.92,17.3
  Bottom 0.203: v21.02,15.39 21.64,14.78 22.37,14.78 22.5,14.91 30.89,14.91 31.23,15.24 34.97,15.24 v35.58,14.63
D26  (via drill 0.3)
  Top 0.203: v34.62,14.63 36.72,16.73 IC1.59
  Top 0.254: CON1.57 CON3.P$25
  Bottom 0.203: 34.39,14.4 v34.62,14.63 34.35,14.36 20.36,14.36 20.09,14.63 17.75,14.63 17.74,14.64 CON1.57
D27  (via drill 0.3)
  Top 0.203: v29.88,16.08 29.88,15.13 30.07,14.94 34,14.94 34.34,15.27 34.67,15.27 36.93,17.53 IC1.58
  Top 0.254: CON3.P$26 CON1.58
  Bottom 0.203: CON1.58 16.6,15.57 17,15.97 18.29,15.97 18.95,15.31 19.96,15.31 20.73,16.08 v29.88,16.08
D28  (via drill 0.3)
  Top 0.203: v30.57,15.54 33.83,15.54 33.97,15.68 34.47,15.68 37.11,18.33 IC1.57 | CON1.59 16.36,12.46 20.8,12.46 22.02,13.69 v22.02,15.39
  Top 0.254: CON3.P$27 CON1.59
  Bottom 0.203: v30.57,15.54 30.42,15.39 v22.02,15.39
D29  (via drill 0.3)
  Top 0.203: v27.65,17.91 23.85,14.11 v23.85,12.8 | v22.23,12.49 21.78,12.49 21.1,11.81 15.21,11.81 CON1.60 13.29,13.78 | v31.45,16.69 34.81,16.69 37.25,19.13 IC1.56
  Top 0.254: CON3.P$28 CON1.60 13.28,13.78 13.34,13.72
  Bottom 0.203: v31.45,16.69 30.23,17.91 v27.65,17.91 | v22.23,12.49 23.54,12.49 v23.85,12.8
D30  (via drill 0.3)
  Top 0.203: v29.92,17.3 34.68,17.3 37.27,19.89 43.27,19.89 IC1.55 | v27.65,16.77 24.78,13.89 24.78,12.57 21.26,9.05 v16.09,9.05
  Top 0.254: CON3.P$29 CON1.61
  Bottom 0.203: v16.09,9.05 16.09,9.14 CON1.61 | v27.65,16.77 29.39,16.77 v29.92,17.3
D31  (via drill 0.3)
  Top 0.203: v27.65,19.13 23.24,14.72 23.24,12.42 20.58,9.76 13.67,9.76 CON1.62 | IC1.54 42.22,20.73 v41.99,20.5
  Top 0.254: CON3.P$30 CON1.62
  Bottom 0.203: v41.99,20.5 40.62,19.13 v27.65,19.13
D+
  Top 0.203: IC3.3 49.3,6.03 | 49.3,6.03 49.3,6.42 R1.1 | 49.3,6.03 49.92,5.41 | 49.92,5.41 X1.3 | 49.92,5.41
D-
  Top 0.178: 47.94,7.46 56.83,7.46
  Top 0.203: IC3.4 46.9,6.42 R2.1 47.94,7.46 | 56.83,7.46 56.88,7.41 X1.2
GND  (via drill 0.3, 0.6)
  Top 0.559: 40.88,20.56 41.85,21.53 IC1.53 44.27,21.53 | IC1.22 60.39,16.73 | 39.88,13.53 IC1.63
  Top 0.61: IC3.2 50.32,3.49 | 38.81,20.56 40.88,20.56 | 38.81,20.56 38.02,21.35 38.02,21.83 C4.1 | 63.5,15.87 63.5,16.59 | v63.5,9.08 C5.1 | IC2.10 70.48,38.73 v70.48,36.83 69.85,36.2 68.89,36.2 C7.1 | IC2.17 IC2.16 IC2.15 81.55,42.6 82.07,42.07 | C6.1 39.88,13.53 39.88,14.73 v39.85,14.76 | IC4.15 20.32,63.98 C9.1 20.48,64.45 v20.48,65.88 | C13.1 v29.69,52.39 | 38.81,20.56 36.75,20.56 v36.67,20.48 | R4.2 82.47,48.9 | 44.27,21.53 45.24,20.56 v45.24,19.53 | C1.1 54.02,9.17 v54.29,8.89 | IC1.6 49.12,9.86 v49.13,9.84 | 60.39,16.73 60.48,16.83 63.1,16.83
  Bottom 0.61: C8.1 X1.4 | v63.5,9.08 63.5,8.89
  other vias: 66.28,35.48 73.18,9.16 73.42,25.83 31.27,8.02 65.88,6.27 85.88,31.43 85.8,36.83 55.24,19.13 55.24,22.94 44.05,2.22 27.15,8.41 15.64,1.27 1.67,20.8 15,34.21 18.73,38.02 1.59,41.91 14.13,64.29 33.02,52.86 40.72,78.34 69.93,78.5 82.71,66.6 85.09,40.24 85.33,17.3 78.82,13.89 45.49,14.57 55.97,38.67 54.57,41.56 50.84,4.25 57.98,2.14 67.47,49.45
  pour Top: 62.55,8.57 73.98,8.57 73.98,26.35 62.55,26.35
  pour Bottom (isolate 0.254): 0.64,79.38 0.64,0.64 87,0.64 87,79.38
  pour Top (isolate 0.254): 0.64,0.64 0.64,79.38 87,79.38 87,27.54 87,0.64 60.8,0.64 60.8,6.91 75.41,6.91 75.41,27.54 60.8,27.54 60.8,0.64
MISO  (via drill 0.3)
  Top 0.203: v78.11,33.38 77.27,33.38 74.81,35.84 IC2.14 | v60.69,6.41 62.85,6.41 63.58,7.14 81.68,7.14 83.19,8.65 83.19,19.53 84.06,20.4 84.06,22.15 JP1.1 85.21,23.34 85.19,23.32 | IC1.13 54.72,10.21 55.17,9.76 | 55.17,9.76 55.55,9.76 56.8,8.51 57.99,8.51 58.56,7.93 v58.56,7.44 | 55.17,9.76
  Bottom 0.203: v78.11,33.38 85.19,26.29 85.19,23.39 JP1.1 | v60.69,6.41 58.93,6.41 58.56,6.78 v58.56,7.44
MOSI  (via drill 0.3)
  Top 0.178: 81.11,24.3 81.11,31.32
  Top 0.203: v60.66,8.53 61.19,8.53 62.1,7.62 81.52,7.62 82.71,8.81 JP1.4 82.68,20.83 82.68,20.88 81.44,22.12 81.44,23.98 81.11,24.3 | v55.85,8.38 55.76,8.48 55.76,8.89 55.33,9.33 54.89,9.33 53.92,10.3 IC1.12 | 81.11,31.32 v80.86,31.58 | IC2.13 74.41,37.27 75.37,37.27 76.04,36.59 76.04,36.35 78.98,33.41 v79.06,33.41
  Bottom 0.203: v55.85,8.38 56.62,9.14 60.05,9.14 v60.66,8.53 | v79.06,33.41 80.86,31.62 v80.86,31.58
N$1
  Top 0.203: IC1.5 48.32,9.31 R1.2
N$2
  Top 0.203: IC1.4 47.52,8.94 R2.2
N$3
  Top 0.203: IC1.23 65.1,17.53 66.36,16.27 Q1.2 | Q1.2 | Q1.2 70.47,13.19 C2.2
N$4
  Top 0.203: IC1.24 65.08,18.33 66.36,19.61 Q1.1 | Q1.1 | Q1.1 70.47,22.84 C3.2
N$5
  Top 0.305: 19.05,52.86 IC4.1 | 19.05,52.86 | 19.05,52.86 19.05,52.71 C10.2
N$6
  Top 0.203: C1.2 50.52,9.17 49.99,9.7 49.99,10.86 IC1.7
N$7
  Top 0.305: IC4.3 21.59,52.71 C10.1
N$8
  Top 0.305: IC4.5 24.13,54.29 25,53.42 25,51.28 24.21,50.48 C11.1
N$9
  Top 0.305: IC4.4 22.86,53.02 C11.2
N$10
  Top 0.305: C12.1 19.37,57.47 20.32,56.52 IC4.2 | IC4.2
N$11
  Top 0.305: IC4.6 25.4,54.13 26.04,53.5 26.04,52.71 C13.2
N$12
  Top 0.305: IC4.14 21.59,62.87 22.07,63.34 22.07,66.67 20.88,67.86 X2.2
N$13
  Top 0.305: IC4.13 22.86,62.39 23.65,63.18 X2.3
N$14
  Top 0.203: LED1.A 58.9,32.38 58.75,32.23 58.75,24.92 58.92,24.75 IC1.32
N$15
  Top 0.203: LED1.C 61.06,33.59 R6.2
RX  (via drill 0.3)
  Top 0.203: v61.27,26.67 v61.27,20.73 | v41.71,35.74 41.71,36.11 31.08,46.74 31.08,56.31 27.3,60.09 27.3,62.04 26.71,62.63 24.69,62.63 24.16,62.1 24.16,61.27 24.13,61.24 IC4.12 | IC1.27 v60.05,20.73 | v52.27,35.66 57.06,30.88 v57.07,30.88
  Bottom 0.203: v61.27,20.73 v60.05,20.73 | v57.07,30.88 61.27,26.68 v61.27,26.67 | v52.27,35.66 41.79,35.66 v41.71,35.74
SCK  (via drill 0.3)
  Top 0.178: 73.03,30.79 73.03,35.23
  Top 0.203: v68.66,30.79 73.03,30.79 74.44,29.37 v74.44,29.34 | IC1.11 53.12,11.68 53.58,12.14 54.93,12.14 56.52,13.73 56.52,14.29 56.95,14.72 56.95,16.35 57.31,16.71 57.31,20.32 v57.72,20.73 | IC2.12 72.15,36.81 72.15,36.12 73.03,35.24 73.03,35.23
  Bottom 0.203: v57.72,20.73 59.31,22.32 60.2,22.32 v68.66,30.79 | v74.44,29.34 76.73,29.34 82.71,23.36 JP1.3
SIMM_!CS  (via drill 0.3)
  Top 0.203: v74.47,11.05 74.6,11.18 | v66.6,55.85 66.6,48.25 70.68,44.17 70.68,41.63 68.82,39.77 68.58,39.77 67.51,38.7 67.51,34.97 67.59,34.89 67.59,30.84 68.34,30.08 71.11,30.08 74.6,26.59 74.6,11.18 | IC1.14 55.52,10.32 55.6,10.24 55.68,10.24 56.32,9.6 57.9,9.6 v58.65,10.36 | 74.6,11.18
  Top 0.254: CON1.11 CON2.P$11
  Bottom 0.203: v58.65,10.36 59.38,11.09 60.21,11.09 60.25,11.05 v74.47,11.05 | v66.6,55.85 62.94,59.51 62.71,59.51
  Bottom 0.254: 62.71,59.51 CON1.11
SIMM_!OE  (via drill 0.3)
  Top 0.203: v57.91,25.83 57.98,25.91 57.98,38.96 v58.58,39.55 | v61.42,39.93 63.59,39.93 68.1,44.44 68.1,45.36 64.69,48.77 v64.69,55.47 | IC1.15 56.32,11.88 v55.97,12.22 | v56.69,24.61 56.28,24.2 56.28,17.22 55.76,16.71 55.76,15 54.59,13.83 v54.59,13.61
  Top 0.254: CON1.12 CON2.P$12
  Bottom 0.203: v55.97,12.22 v54.59,13.61 | v56.69,24.61 v57.91,25.83 | v58.58,39.55 61.04,39.55 v61.42,39.93 | CON1.12 61.95,58.47 61.95,57.23 62.39,56.79 63.38,56.79 v64.69,55.47
SIMM_!WE  (via drill 0.3)
  Top 0.203: v60.66,18.98 60.66,30.61 60.01,31.26 60.01,33.34 59.82,33.53 59.82,38.94 59.36,39.4 59.36,49.99 v60.12,50.75 | v61.72,52.35 61.72,56.9 CON1.13 | IC1.16 57.12,12.85 v57.23,12.95
  Top 0.254: CON1.13 CON2.P$13
  Bottom 0.203: v57.23,12.95 60.66,16.38 v60.66,18.98 | v60.12,50.75 v61.72,52.35
TX  (via drill 0.3)
  Top 0.203: v41.3,23.56 40.62,24.24 40.62,36.42 30.56,46.48 30.56,56.01 26.5,60.07 25.92,60.07 25.4,60.59 IC4.11 | v57.38,22.15 58,21.53 IC1.28
  Bottom 0.203: v57.38,22.15 48.66,22.15 47.24,23.56 v41.3,23.56
VCC
  Top 0.508: CON1.46 29.05,23.12 29.05,22.86 29.05,13 29.05,2.06 30.32,0.79 30.4,0.79 | IC1.8 50.72,11.82 50.67,11.87 50.37,12.17 47.12,12.17 47.12,12.14 46.72,11.73 IC1.3
  Top 0.559: 41.2,22.3 43.29,22.3 IC1.52 | 61.54,15.93 IC1.21 | 41.31,12.73 IC1.64 43.85,12.73 44.37,12.22 46.23,12.22 46.72,11.73
  Top 0.61: 45.56,0.79 45.56,2.7 46.35,3.49 IC3.5 | 30.4,0.79 45.56,0.79 | 41.2,22.3 40.8,21.91 C4.2 39.84,22.39 38.73,23.5 33.02,23.5 32.38,22.86 29.05,22.86 | 87,20.76 87,2.38 85.41,0.79 59.53,0.79 | 87,20.76 87,26.51 | 87,26.51 87,32.54 | 87,32.54 87,38.1 | C7.2 68.58,38.63 IC2.9 71.23,41.27 72.39,41.27 75.56,38.1 87,38.1 | 87,38.1 87,65.01 83.45,68.56 CON1.1 CON2.P$1 | CON1.46 CON3.P$14 18.79,33.59 14.61,37.78 C12.2 14.61,62.23 16.67,64.29 C9.2 19.05,63.98 IC4.16 | 58.61,6.19 58.58,6.16 58.58,4.92 59.53,3.97 59.53,0.79 | 87,32.54 R3.2 | 87,32.54 | 87,26.51 R5.2 | 45.56,0.79 59.53,0.79 | 58.61,6.19 | 58.61,6.19 X1.1 59.83,9.37 59.85,9.37 61.6,11.12 C5.2 61.6,15.88 61.54,15.93 | JP1.2 86.96,20.8 87,20.76 | 41.31,12.73 40.64,12.06 38.73,12.06 38.1,12.7 38.1,13.02 C6.2 37.45,13 29.05,13
  Bottom 0.61: 61.91,7.41 C8.2 61.78,7.43 59.85,7.43 X1.1

### Text on the board
tPlace: SIMM Programmer 1.0
tNames: 59993 | 1 | 3 | 5 | 7 | 9 | SIMM | 11 | RS232 | 13 | 15 | 17 | 19 | 21 | 23 | 25 | 27 | 29 | 31 | 33 | 35 | 37 | 39 | 41 | 43 | 45 | 47 | 49 | 51 | 53 | 55 | 57 | ISP | 59 | 61 | 63 | USB